# Altium schematic sheet Extension Knocklet.SchDoc: Extension Knocklet
size A4; Date: 19/01/2017; Author: Nicolas LAW; DrawnBy: Nicolas LAW; Engineer: Nicolas LAW; Revision: 1; SheetNumber: 3; SheetTotal: 3
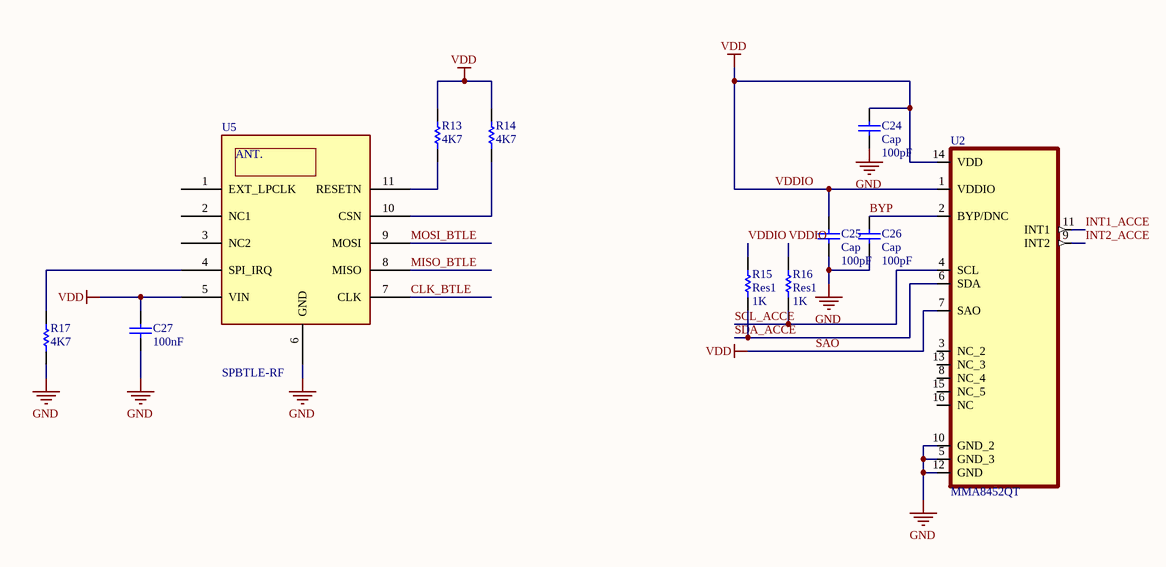
[diagram p0: Extension Knocklet.SchDoc]

## Parts
C24  Cap  value 100pF  [RAD-0.3]
C25  Cap  value 100pF  [RAD-0.3]
C26  Cap  value 100pF  [RAD-0.3]
C27  100nF  [0603]
R13  4K7  [0402R]
R14  4K7  [0402R]
R15  Res1  value 1K  [AXIAL-0.3]
R16  Res1  value 1K  [AXIAL-0.3]
R17  4K7  [0402R]
U2  MMA8452QT  [MMA8452QT]
U5  SPBTLE-RF  [SPBTLE-RF]

## Nets
GND: C24.1 C25.1 C26.1 C27.1 R17.2 U2.5(GND_3) U2.10(GND_2) U2.12(GND) U5.6(GND)
SAO: C24.2 C25.2 C27.2 R13.1 R14.1 R15.2 R16.2 U2.1(VDDIO) U2.7(SAO) U2.14(VDD) U5.5(VIN)  [also labelled VDD, VDDIO]
BYP: C26.2 U2.2(BYP/DNC)
CLK_BTLE: U5.7(CLK)
INT1_ACCE: U2.11(INT1)
INT2_ACCE: U2.9(INT2)
MISO_BTLE: U5.8(MISO)
MOSI_BTLE: U5.9(MOSI)
SCL_ACCE: R16.1 U2.4(SCL)
SDA_ACCE: R15.1 U2.6(SDA)
NetR13_2: R13.2 U5.11(RESETN)
NetR14_2: R14.2 U5.10(CSN)
NetR17_1: R17.1 U5.4(SPI_IRQ)

Not connected (* = marked no-connect by the designer): U2 3(NC_2) 8(NC_4) 13(NC_3) 15(NC_5) 16(NC); U5 1(EXT_LPCLK) 2(NC1) 3(NC2)

## Notes on the sheet
- Title
- Size:
- Date:
- A4
- Number:
- Time:
- Revision:
- Sheet
- of
- File:
- (in symbol SPBTLE-RF) ANT.

## Library data of the parts
C24-C26 = Cap: Capacitor; Published: 8-Jun-2000; LatestRevisionDate: 17-Jul-2002; LatestRevisionNote: Re-released for DXP Platform.; PackageReference: RAD-0.3; Publisher: Altium Limited; PackageDescription: Radial Cap, Thru-Hole; 2 Leads; 0.3 in Pin Spacing
C27 = Cap: Capacitor; Value: 10nF; Published: 8-Jun-2000; Revision: July-2002: Re-released for DXP Platform.; Publisher: Altium Limited
R13 R14 R17 = Res1: Resistor; Value: 1K; Published: 8-Jun-2000; Revision: July-2002: Re-released for DXP Platform.; Publisher: Altium Limited
R15 R16 = Res1: Resistor; Published: 8-Jun-2000; LatestRevisionDate: 17-Jul-2002; LatestRevisionNote: Re-released for DXP Platform.; PackageReference: AXIAL-0.3; Publisher: Altium Limited; PackageDescription: Axial Device, Thru-Hole; 2 Leads; 0.3 in Pin Spacing
U5 = SPBTLE-RF: Module BlueNRG